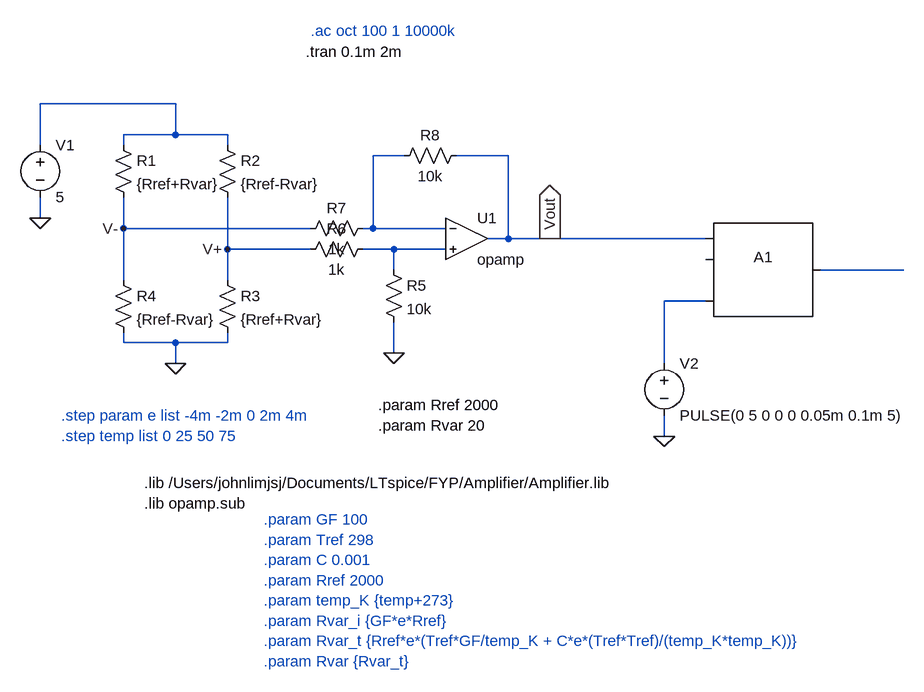
[diagram p0: schematic PZR_subtractor.asc]
PZR_subtractor.asc, the LTspice schematic file:
Version 4
SHEET 1 1700 904
WIRE 240 96 32 96
WIRE 240 144 240 96
WIRE 240 144 160 144
WIRE 320 144 240 144
WIRE 32 160 32 96
WIRE 160 160 160 144
WIRE 320 160 320 144
WIRE 592 176 544 176
WIRE 752 176 672 176
WIRE 32 272 32 240
WIRE 160 288 160 240
WIRE 448 288 160 288
WIRE 544 288 544 176
WIRE 544 288 528 288
WIRE 656 288 544 288
WIRE 752 304 752 176
WIRE 752 304 720 304
WIRE 816 304 752 304
WIRE 1056 304 816 304
WIRE 320 320 320 240
WIRE 448 320 320 320
WIRE 576 320 528 320
WIRE 656 320 576 320
WIRE 576 352 576 320
WIRE 1360 352 1232 352
WIRE 160 368 160 288
WIRE 320 368 320 320
WIRE 1056 400 992 400
WIRE 160 464 160 448
WIRE 240 464 160 464
WIRE 320 464 320 448
WIRE 320 464 240 464
WIRE 576 480 576 432
WIRE 240 496 240 464
WIRE 992 496 992 400
WIRE 992 608 992 576
FLAG 32 272 0
FLAG 576 480 0
FLAG 816 304 Vout
IOPIN 816 304 Out
FLAG 240 496 0
FLAG 160 288 V-
FLAG 320 320 V+
FLAG 992 608 0
SYMBOL res 144 144 R0
SYMATTR InstName R1
SYMATTR Value {Rref+Rvar}
SYMBOL res 304 144 R0
SYMATTR InstName R2
SYMATTR Value {Rref-Rvar}
SYMBOL res 304 352 R0
SYMATTR InstName R3
SYMATTR Value {Rref+Rvar}
SYMBOL res 144 352 R0
SYMATTR InstName R4
SYMATTR Value {Rref-Rvar}
SYMBOL voltage 32 144 R0
SYMATTR InstName V1
SYMATTR Value 5
SYMATTR Value2 AC 10
SYMBOL Opamps/opamp 688 240 R0
SYMATTR InstName U1
SYMBOL res 560 336 R0
SYMATTR InstName R5
SYMATTR Value 10k
SYMBOL res 688 160 R90
WINDOW 0 0 56 VBottom 2
WINDOW 3 32 56 VTop 2
SYMATTR InstName R8
SYMATTR Value 10k
SYMBOL res 544 304 R90
WINDOW 0 0 56 VBottom 2
WINDOW 3 32 56 VTop 2
SYMATTR InstName R6
SYMATTR Value 1k
SYMBOL res 544 272 R90
WINDOW 0 0 56 VBottom 2
WINDOW 3 32 56 VTop 2
SYMATTR InstName R7
SYMATTR Value 1k
SYMBOL SpecialFunctions/sample 1136 336 R0
SYMATTR InstName A1
SYMBOL voltage 992 480 R0
SYMATTR InstName V2
SYMATTR Value PULSE(0 5 0 0 0 0.05m 0.1m 5)
SYMATTR Value2 AC 10
TEXT 192 680 Left 2 !.lib /Users/johnlimjsj/Documents/LTspice/FYP/Amplifier/Amplifier.lib\n.lib opamp.sub
TEXT 552 560 Left 2 !.param Rref 2000\n.param Rvar 20
TEXT 440 16 Left 2 !.tran 0.1m 2m
TEXT 448 -16 Left 2 ;.ac oct 100 1 10000k
TEXT 64 576 Left 2 ;.step param e list -4m -2m 0 2m 4m\n.step temp list 0 25 50 75
TEXT 376 736 Left 2 ;.param GF 100\n.param Tref 298\n.param C 0.001\n.param Rref 2000\n.param temp_K {temp+273}\n.param Rvar_i {GF*e*Rref}\n.param Rvar_t {Rref*e*(Tref*GF/temp_K + C*e*(Tref*Tref)/(temp_K*temp_K))}\n.param Rvar {Rvar_t}

The netlist it stands for:
* PZR_subtractor.asc
R1 N001 V- {Rref+Rvar}
R2 N001 V+ {Rref-Rvar}
R3 V+ 0 {Rref+Rvar}
R4 V- 0 {Rref-Rvar}
V1 N001 0 5 AC 10
XU1 N002 N003 Vout opamp Aol=100K GBW=10Meg  ; pins invin noninvin out
R5 N003 0 10k
R8 Vout N002 10k
R6 N003 V+ 1k
R7 N002 V- 1k
A1 Vout 0 0 N005 0 0 N004 0 SAMPLEHOLD
V2 N005 0 PULSE(0 5 0 0 0 0.05m 0.1m 5) AC 10
.lib /Users/johnlimjsj/Documents/LTspice/FYP/Amplifier/Amplifier.lib
.lib opamp.sub
.param Rref 2000
.param Rvar 20
.tran 0.1m 2m
* .ac oct 100 1 10000k
* .step param e list -4m -2m 0 2m 4m
* .step temp list 0 25 50 75
* .param GF 100
* .param Tref 298
* .param C 0.001
* .param Rref 2000
* .param temp_K {temp+273}
* .param Rvar_i {GF*e*Rref}
* .param Rvar_t {Rref*e*(Tref*GF/temp_K + C*e*(Tref*Tref)/(temp_K*temp_K))}
* .param Rvar {Rvar_t}
.backanno
.end